# EAGLE schematic AGC-Amplifier-LM13600-Monosch (EAGLE 7.2.0)
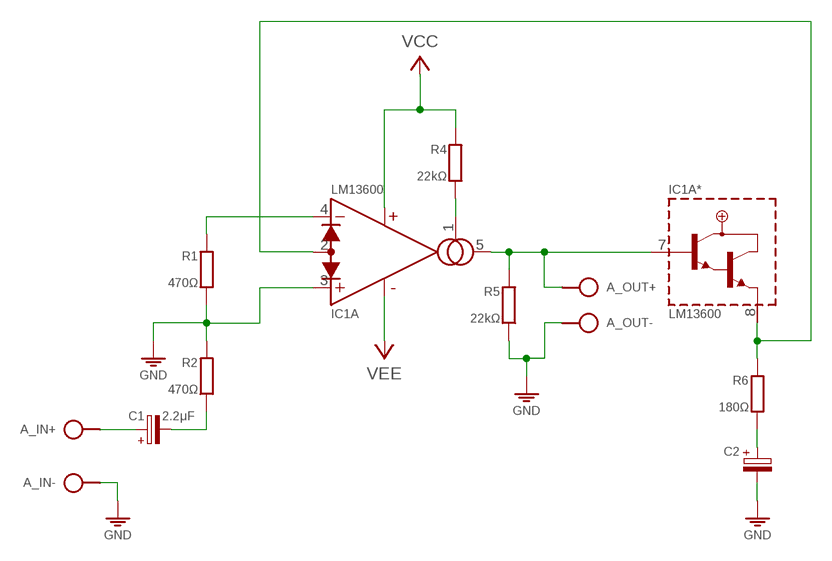
[diagram p0: schematic, sheet 1]

## Parts
A_IN  SPAD+--+  [SPAD-+]
A_OUT  SPAD+-+-  [SPAD+-]
C1  2.2μF  CPOL-HE2,5-4  [E2,5-4]
C2  CPOLE2,5-4/V  [E2.5-4/V]
IC1  LM13600  [DIL16]
R1  470Ω  R0204/10-V  [0204/10-V]
R2  470Ω  R0204/10-V  [0204/10-V]
R4  22kΩ  R0204/10-V  [0204/10-V]
R5  22kΩ  R0204/10-V  [0204/10-V]
R6  180Ω  R0204/10-V  [0204/10-V]
U$3  VCC_GND_VEE  [SPAD-3]

## Nets
GND: A_IN.1 A_OUT.1 C2.- IC1.3(A:+IN) R1.2 R2.1 R5.2 U$3.2
N$1: IC1.1(A:AMP/BIAS) R4.2
N$2: C1.- R2.2
N$3: C2.+ R6.2
N$4: IC1.4(A:-IN) R1.1
N$5: IC1.2(A:DIODE/BIAS) IC1.8(A*:BUFF/OUT) R6.1
N$6: A_IN.2 C1.+
N$7: A_OUT.2 IC1.5(A:OUT) IC1.7(A*:BUFF/IN) R5.1
VCC: IC1.11(5:V+) R4.1 U$3.1
VEE: IC1.6(5:V-) U$3.3
Unconnected: IC1.9(B*:BUFF/IN) IC1.10(B*:BUFF/OUT) IC1.12(B:OUT) IC1.13(B:-IN) IC1.14(B:+IN) IC1.15(B:DIODE/BIAS) IC1.16(B:AMP/BIAS)

## Library data of the parts
A_IN A_OUT = pad:SPAD+-
C1 = c:CPOL-H
C2 = c:CPOL: POLARIZED CAPACITOR, European symbol
IC1 = ic:LM13600
R1 R2 R4-R6 = r:R: RESISTOR, European symbol
U$3 = pad:VCC_GND_VEE